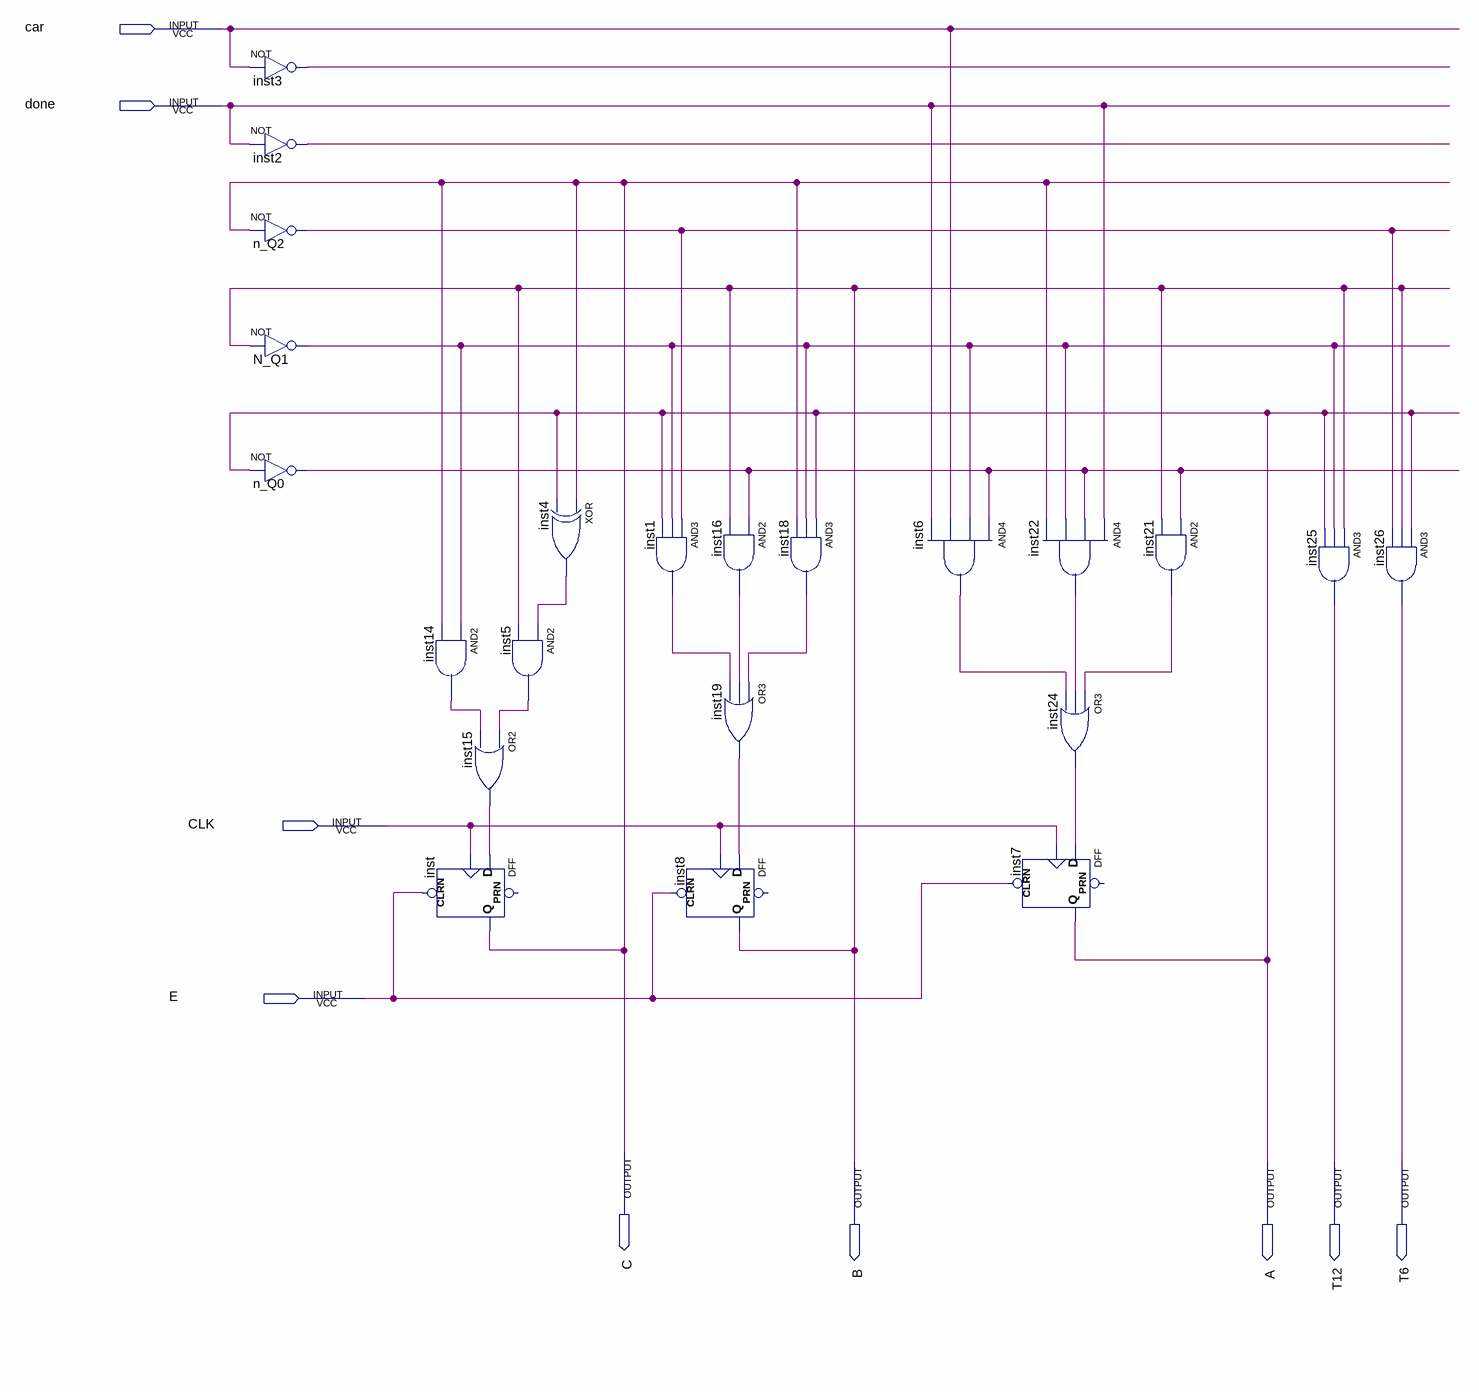
[diagram p0: schematic sheet]
// Quartus schematic lightcontroller.bdf as structural Verilog: 22 symbols, 9 pins
module lightcontroller (
  input  car,
  input  done,
  input  CLK,
  input  E,
  output C,
  output B,
  output A,
  output T12,
  output T6
);

  wire inst1_out, inst2_out, inst3_out, inst4_out, inst5_out, inst6_out, inst14_out, inst15_out, inst16_out,
       inst18_out, inst19_out, inst21_out, inst22_out, inst24_out, n_Q0_out, N_Q1_out, n_Q2_out;

  not inst3 (inst3_out, car);
  not inst2 (inst2_out, done);
  not n_Q2 (n_Q2_out, C);
  not N_Q1 (N_Q1_out, B);
  not n_Q0 (n_Q0_out, A);
  and inst14 (inst14_out, N_Q1_out, C);
  DFF inst (.CLRN(E), .CLK(CLK), .D(inst15_out), .Q(C));  // open: PRN
  and inst5 (inst5_out, inst4_out, B);
  or inst15 (inst15_out, inst5_out, inst14_out);
  xor inst4 (inst4_out, C, A);
  and inst1 (inst1_out, n_Q2_out, N_Q1_out, A);
  DFF inst8 (.CLRN(E), .CLK(CLK), .D(inst19_out), .Q(B));  // open: PRN
  and inst16 (inst16_out, n_Q0_out, B);
  or inst19 (inst19_out, inst18_out, inst16_out, inst1_out);
  and inst18 (inst18_out, A, N_Q1_out, C);
  and inst6 (inst6_out, n_Q0_out, N_Q1_out, car, done);
  and inst22 (inst22_out, done, n_Q0_out, N_Q1_out, C);
  or inst24 (inst24_out, inst21_out, inst22_out, inst6_out);
  DFF inst7 (.CLRN(E), .CLK(CLK), .D(inst24_out), .Q(A));  // open: PRN
  and inst21 (inst21_out, n_Q0_out, B);
  and inst25 (T12, B, N_Q1_out, A);
  and inst26 (T6, A, B, n_Q2_out);
endmodule
